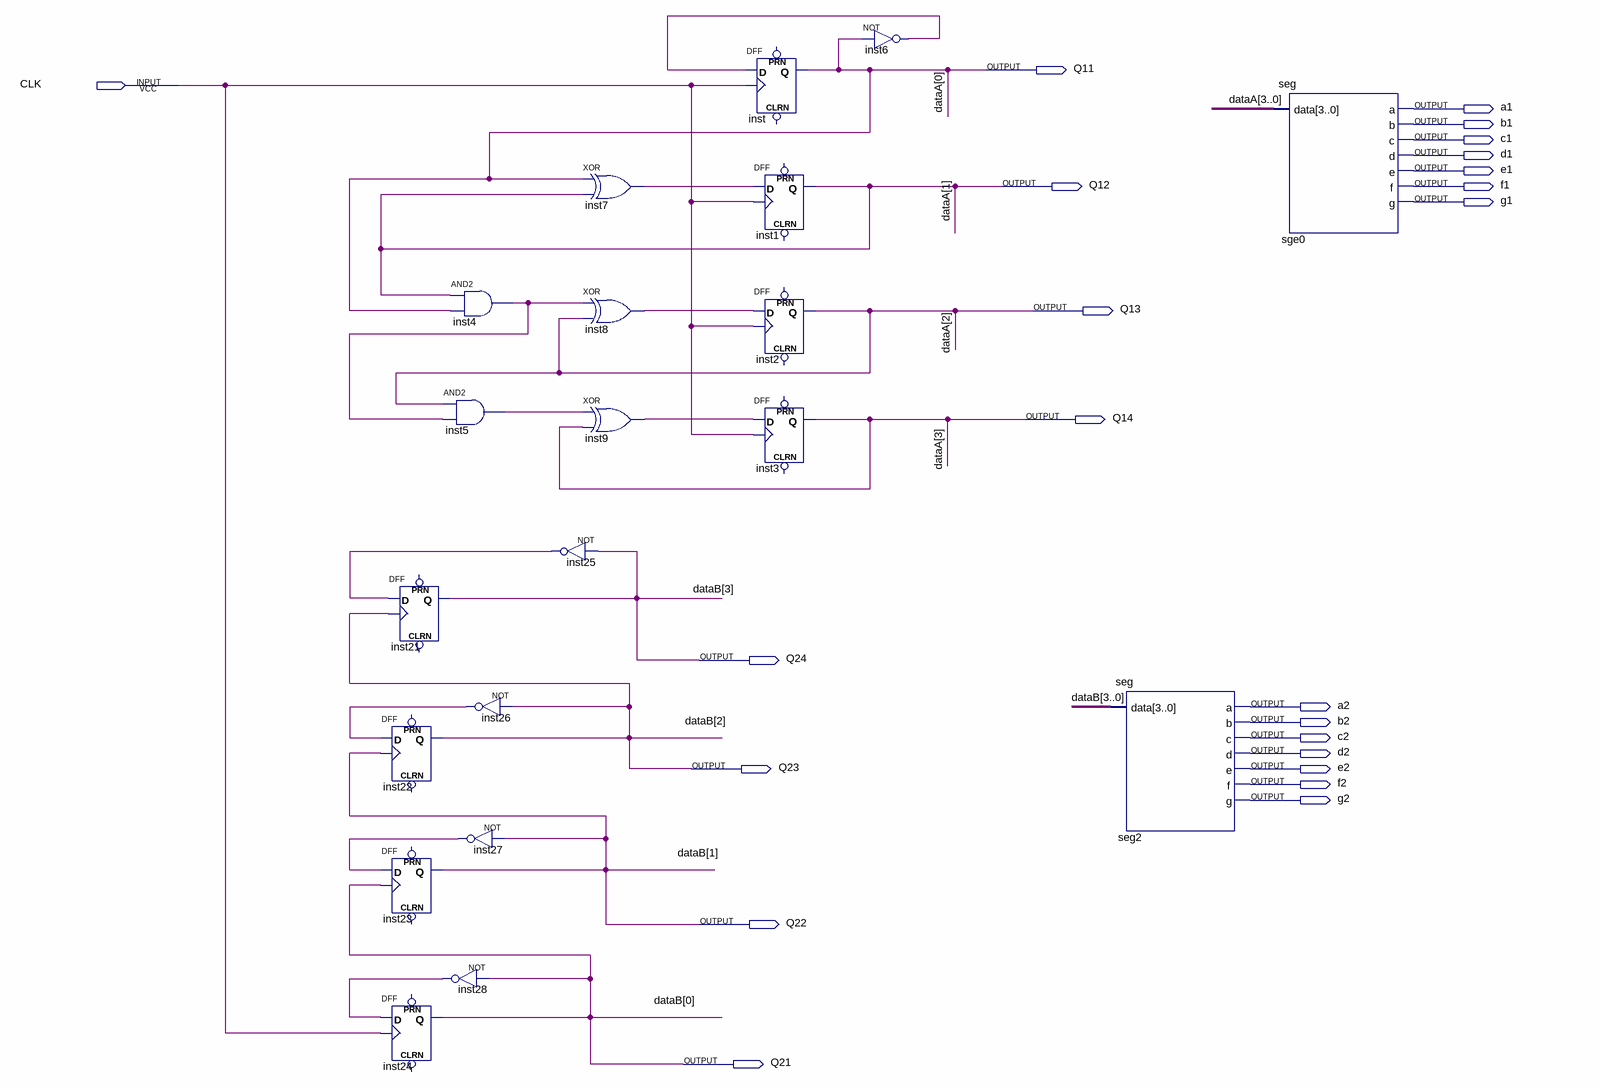
[diagram p0: schematic sheet]
// Quartus schematic lab9.bdf as structural Verilog: 20 symbols, 23 pins
module lab9 (
  input  CLK,
  output Q11,
  output a1,
  output b1,
  output c1,
  output d1,
  output e1,
  output Q12,
  output f1,
  output g1,
  output Q13,
  output Q14,
  output Q24,
  output a2,
  output b2,
  output c2,
  output d2,
  output Q23,
  output e2,
  output f2,
  output g2,
  output Q22,
  output Q21
);

  wire inst4_out, inst5_out, inst6_out, inst7_out, inst8_out, inst9_out, inst25_out, inst26_out, inst27_out,
       inst28_out;

  DFF inst22 (.CLK(Q22), .D(inst26_out), .Q(Q23));  // open: CLRN, PRN
  DFF inst23 (.CLK(Q21), .D(inst27_out), .Q(Q22));  // open: CLRN, PRN
  DFF inst24 (.CLK(CLK), .D(inst28_out), .Q(Q21));  // open: CLRN, PRN
  and inst5 (inst5_out, Q13, inst4_out);
  DFF inst21 (.CLK(Q23), .D(inst25_out), .Q(Q24));  // open: CLRN, PRN
  not inst28 (inst28_out, Q21);
  and inst4 (inst4_out, Q12, Q11);
  not inst26 (inst26_out, Q23);
  not inst27 (inst27_out, Q22);
  not inst25 (inst25_out, Q24);
  xor inst7 (inst7_out, Q11, Q12);
  xor inst8 (inst8_out, inst4_out, Q13);
  xor inst9 (inst9_out, inst5_out, Q14);
  DFF inst (.CLK(CLK), .D(inst6_out), .Q(Q11));  // open: CLRN, PRN
  DFF inst1 (.CLK(CLK), .D(inst7_out), .Q(Q12));  // open: CLRN, PRN
  DFF inst2 (.CLK(CLK), .D(inst8_out), .Q(Q13));  // open: CLRN, PRN
  DFF inst3 (.CLK(CLK), .D(inst9_out), .Q(Q14));  // open: CLRN, PRN
  not inst6 (inst6_out, Q11);
  seg seg2 (.data({Q24, Q23, Q22, Q21}), .a(a2), .b(b2), .c(c2), .d(d2), .e(e2), .f(f2), .g(g2));
  seg sge0 (.data({Q14, Q13, Q12, Q11}), .a(a1), .b(b1), .c(c1), .d(d1), .e(e1), .f(f1), .g(g1));

  // Other names for the same wires on the sheet: dataA[3:0] = {Q14, Q13, Q12, Q11}; dataB[3:0] = {Q24, Q23, Q22, Q21}
endmodule
